# EAGLE schematic display driver rev B (EAGLE 9.6.1)
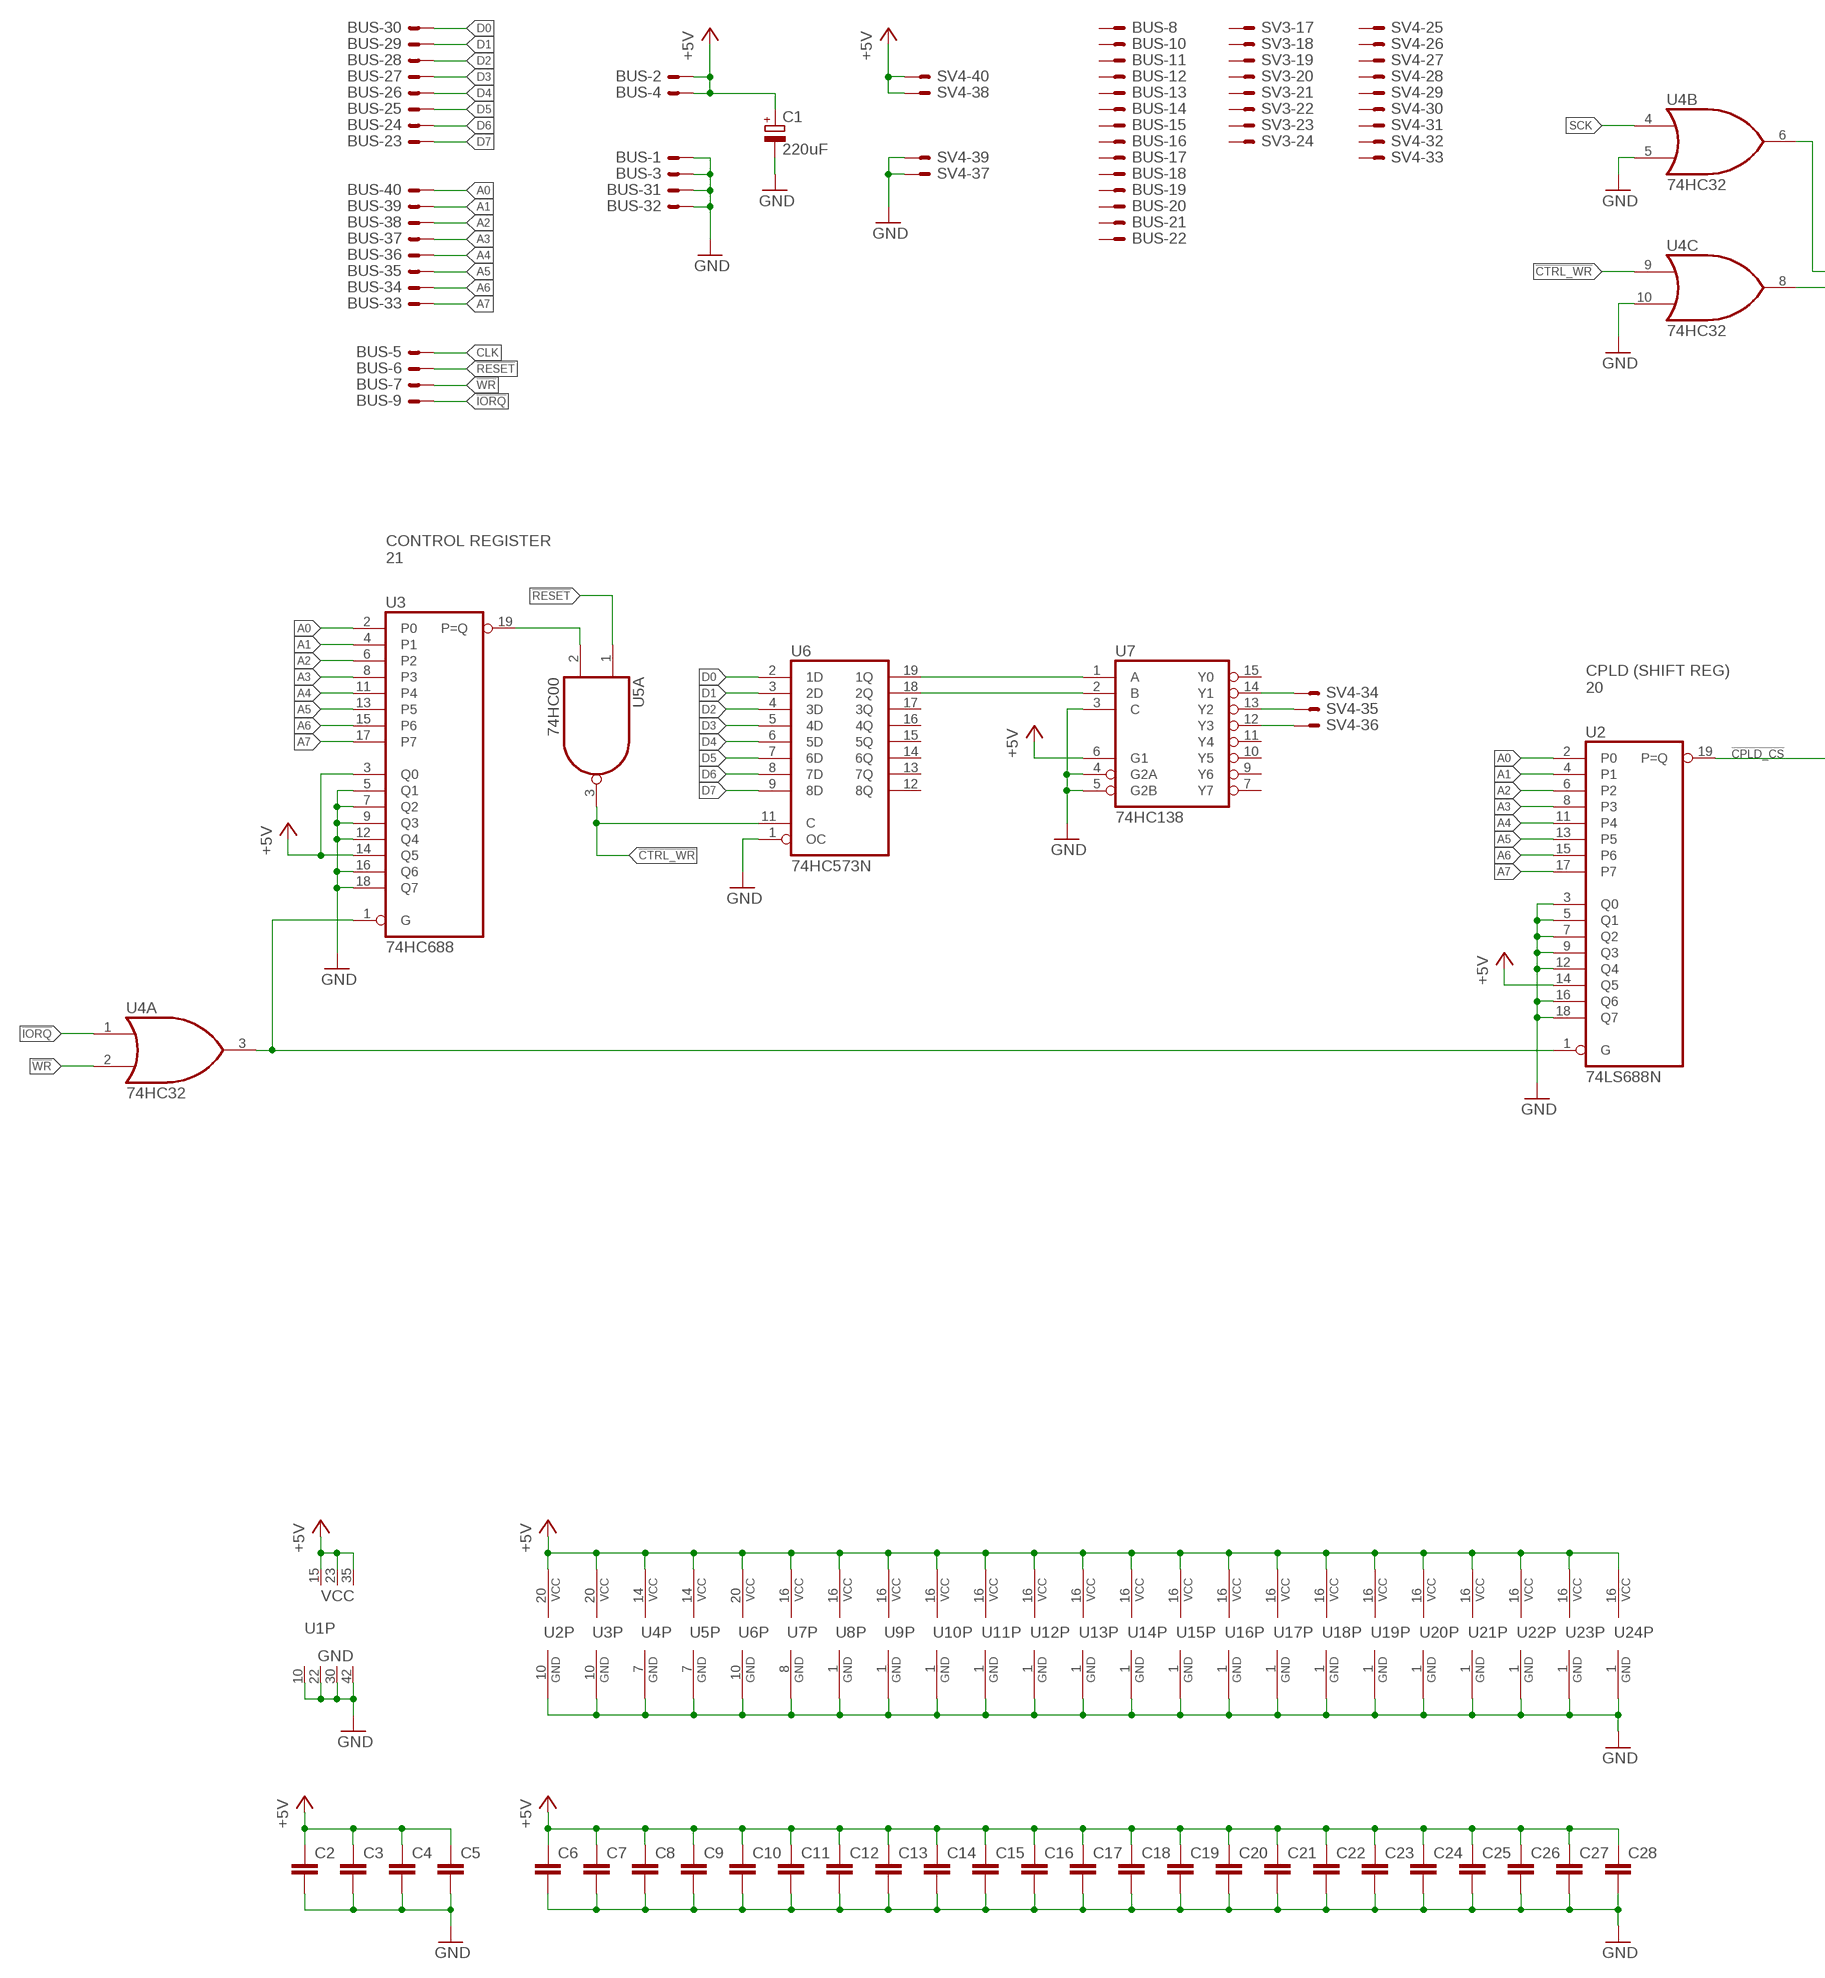
[diagram p0: schematic, sheet 1, part 1 of 2]
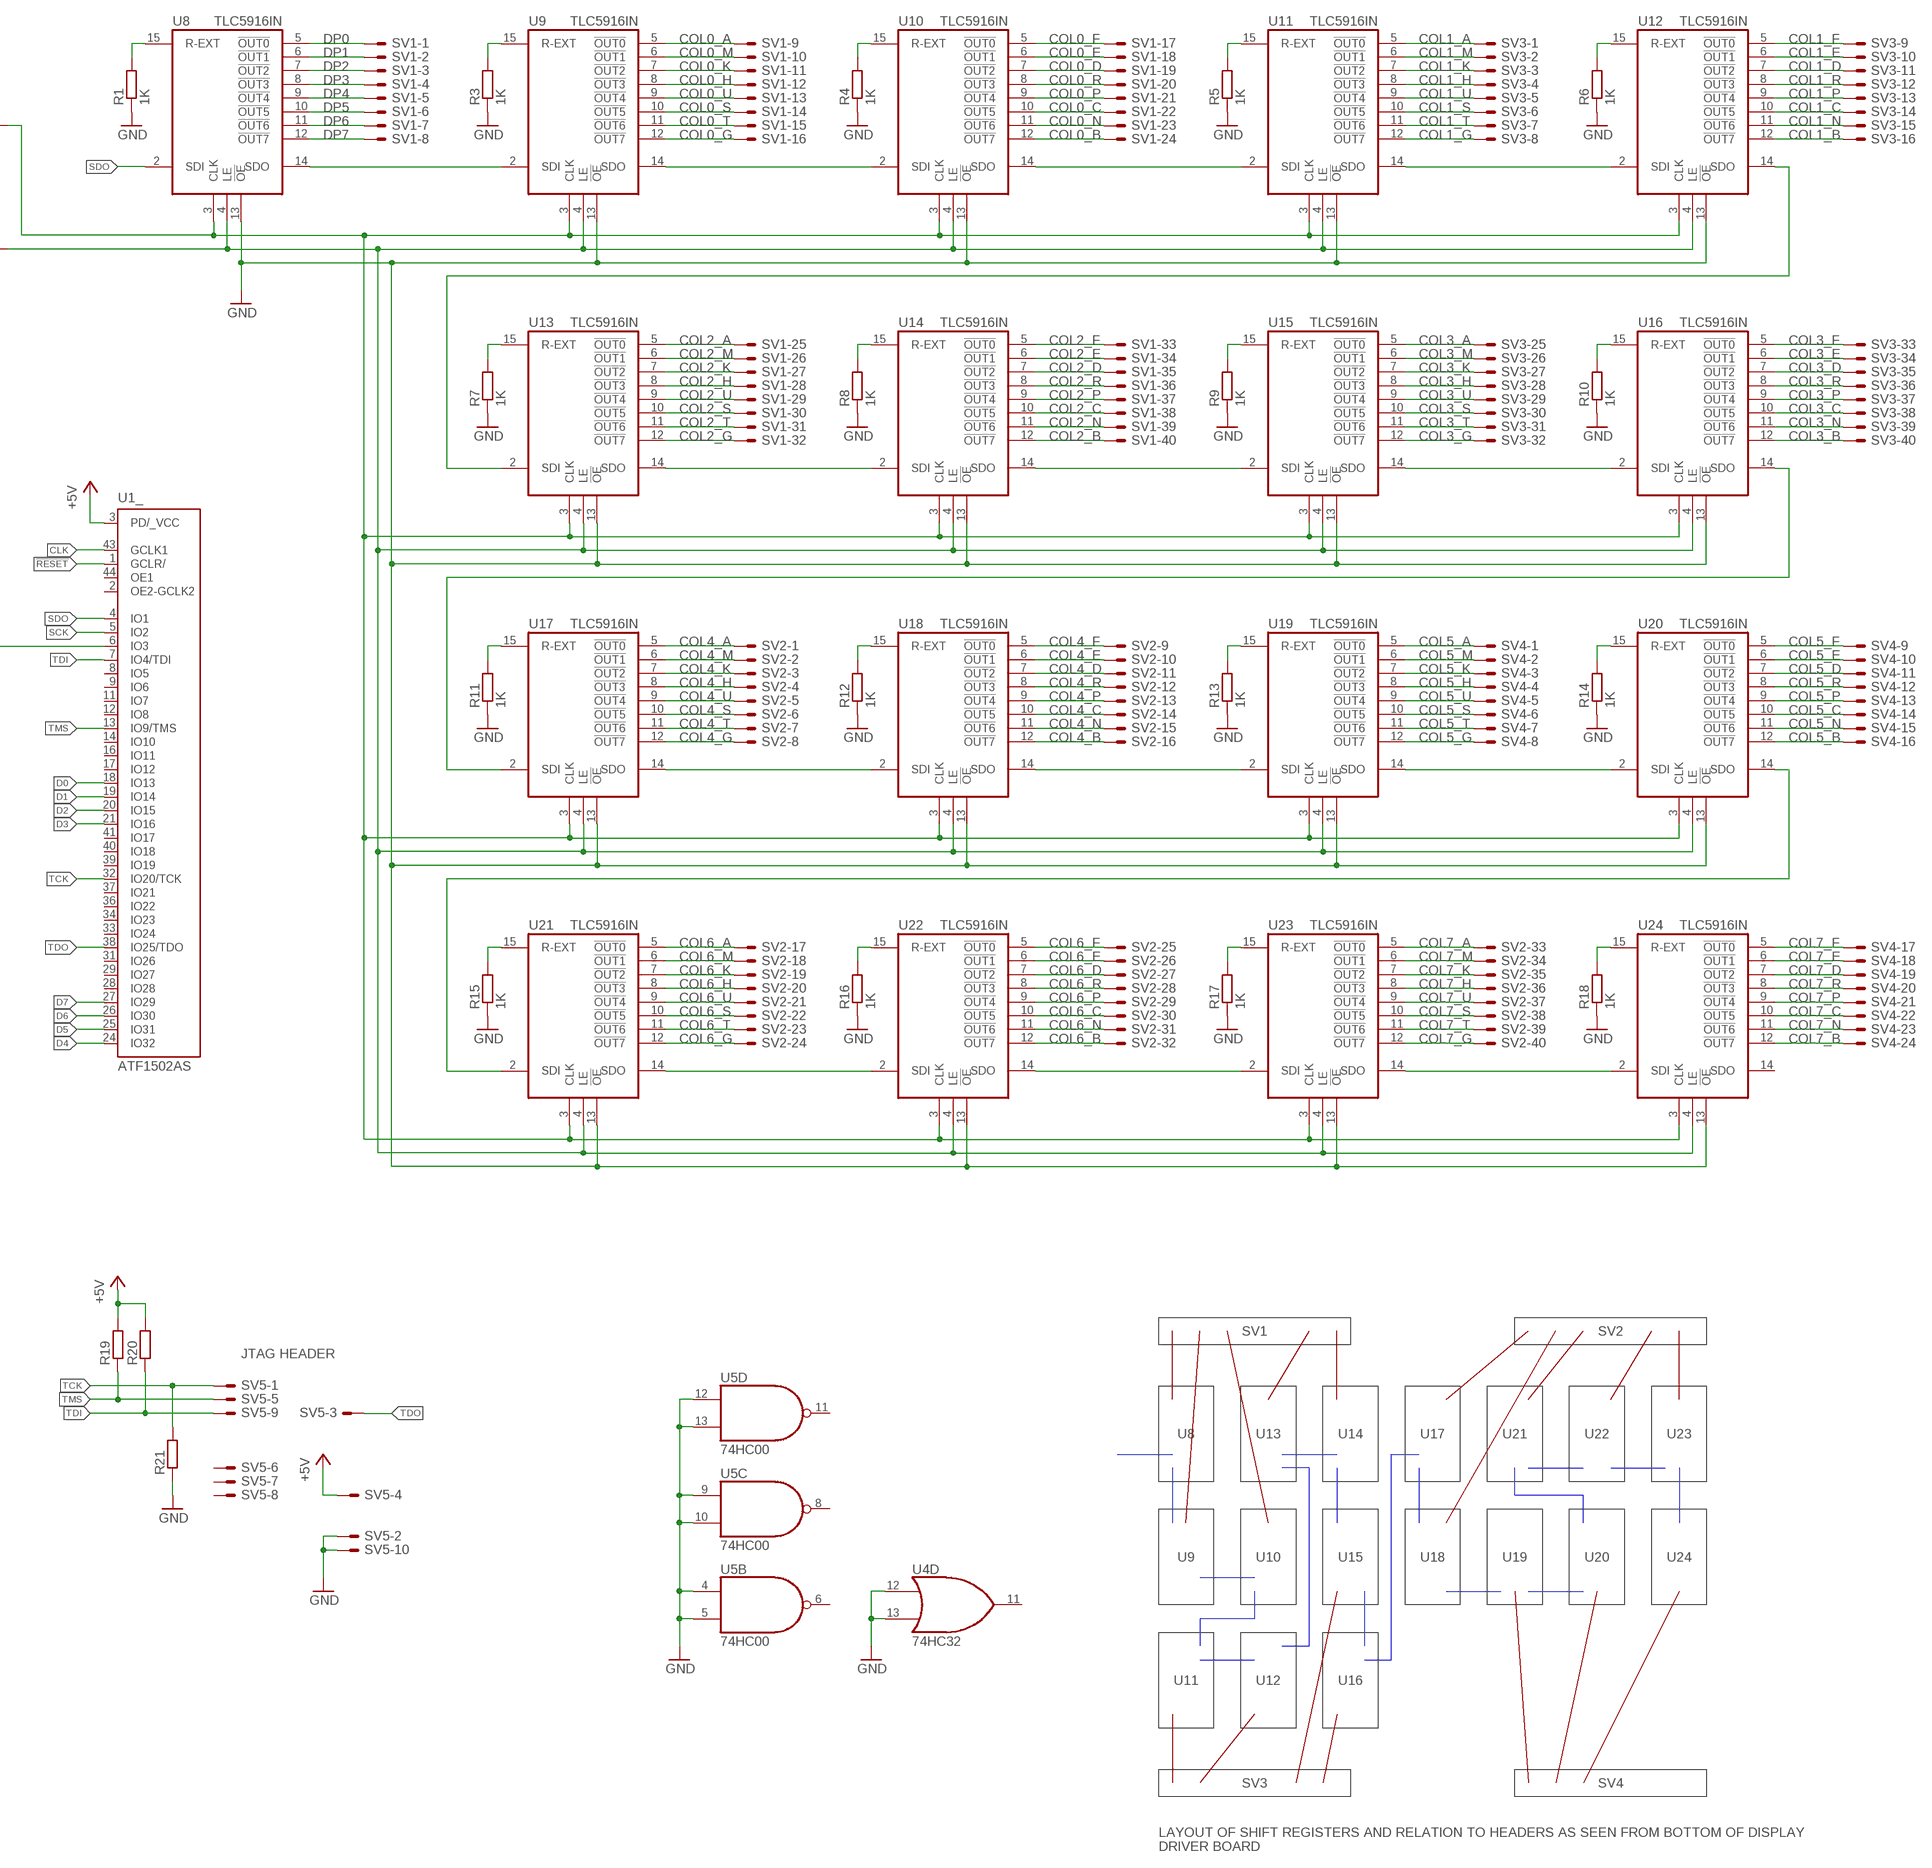
[diagram p1: schematic, sheet 1, part 2 of 2]

## Parts
BUS  ML40E  [ML40]
C1  220uF  CPOL-EUE3.5-8  [E3,5-8]
C2  C-EU050-025X075  [C050-025X075]
C3  C-EU050-025X075  [C050-025X075]
C4  C-EU050-025X075  [C050-025X075]
C5  C-EU050-025X075  [C050-025X075]
C6  C-EU050-025X075  [C050-025X075]
C7  C-EU050-025X075  [C050-025X075]
C8  C-EU050-025X075  [C050-025X075]
C9  C-EU050-025X075  [C050-025X075]
C10  C-EU050-025X075  [C050-025X075]
C11  C-EU050-025X075  [C050-025X075]
C12  C-EU050-025X075  [C050-025X075]
C13  C-EU050-025X075  [C050-025X075]
C14  C-EU050-025X075  [C050-025X075]
C15  C-EU050-025X075  [C050-025X075]
C16  C-EU050-025X075  [C050-025X075]
C17  C-EU050-025X075  [C050-025X075]
C18  C-EU050-025X075  [C050-025X075]
C19  C-EU050-025X075  [C050-025X075]
C20  C-EU050-025X075  [C050-025X075]
C21  C-EU050-025X075  [C050-025X075]
C22  C-EU050-025X075  [C050-025X075]
C23  C-EU050-025X075  [C050-025X075]
C24  C-EU050-025X075  [C050-025X075]
C25  C-EU050-025X075  [C050-025X075]
C26  C-EU050-025X075  [C050-025X075]
C27  C-EU050-025X075  [C050-025X075]
C28  C-EU050-025X075  [C050-025X075]
R1  1K  R-EU_0207/10  [0207/10]
R3  1K  R-EU_0207/10  [0207/10]
R4  1K  R-EU_0207/10  [0207/10]
R5  1K  R-EU_0207/10  [0207/10]
R6  1K  R-EU_0207/10  [0207/10]
R7  1K  R-EU_0207/10  [0207/10]
R8  1K  R-EU_0207/10  [0207/10]
R9  1K  R-EU_0207/10  [0207/10]
R10  1K  R-EU_0207/10  [0207/10]
R11  1K  R-EU_0207/10  [0207/10]
R12  1K  R-EU_0207/10  [0207/10]
R13  1K  R-EU_0207/10  [0207/10]
R14  1K  R-EU_0207/10  [0207/10]
R15  1K  R-EU_0207/10  [0207/10]
R16  1K  R-EU_0207/10  [0207/10]
R17  1K  R-EU_0207/10  [0207/10]
R18  1K  R-EU_0207/10  [0207/10]
R19  R-EU_0207/10  [0207/10]
R20  R-EU_0207/10  [0207/10]
R21  R-EU_0207/10  [0207/10]
SV1  ML40E  [ML40]
SV2  ML40E  [ML40]
SV3  ML40E  [ML40]
SV4  ML40E  [ML40]
SV5  ML10E  [ML10]
U1  ATF1502AS  EPM7032S44  [PLCC-S44]
U2  74LS688N  [DIL20]
U3  74HC688  74LS688N  [DIL20]
U4  74HC32  74LS32N  [DIL14]
U5  74HC00  74LS00N  [DIL14]
U6  74HC573N  [DIL20]
U7  74HC138  74LS138N  [DIL16]
U8  TLC5916IN  [DIL16]
U9  TLC5916IN  [DIL16]
U10  TLC5916IN  [DIL16]
U11  TLC5916IN  [DIL16]
U12  TLC5916IN  [DIL16]
U13  TLC5916IN  [DIL16]
U14  TLC5916IN  [DIL16]
U15  TLC5916IN  [DIL16]
U16  TLC5916IN  [DIL16]
U17  TLC5916IN  [DIL16]
U18  TLC5916IN  [DIL16]
U19  TLC5916IN  [DIL16]
U20  TLC5916IN  [DIL16]
U21  TLC5916IN  [DIL16]
U22  TLC5916IN  [DIL16]
U23  TLC5916IN  [DIL16]
U24  TLC5916IN  [DIL16]

## Nets
!CPLD_CS!: U1.6(_:IO3) U2.19(P=Q)
!CTRL_WR!: U4.9(C:I0) U5.3(A:O) U6.11(C)
!IORQ!: BUS.9 U4.1(A:I0)
!RESET!: BUS.6 U1.1(_:GCLR/) U5.1(A:I0)
!WR!: BUS.7 U4.2(A:I1)
+5V: BUS.2 BUS.4 C1.+ C2.1 C3.1 C4.1 C5.1 C6.1 C7.1 C8.1 C9.1 C10.1 C11.1 C12.1 C13.1 C14.1 C15.1 C16.1 C17.1 C18.1 C19.1 C20.1 C21.1 C22.1 C23.1 C24.1 C25.1 C26.1 C27.1 C28.1 R19.2 R20.2 SV4.38 SV4.40 SV5.4 U1.3(_:PD/_VCC) U1.15(P:VCC) U1.23(P:VCC) U1.35(P:VCC) U2.14(Q5) U2.20(VCC) U3.3(Q0) U3.14(Q5) U3.20(VCC) U4.14(P:VCC) U5.14(P:VCC) U6.20(VCC) U7.6(G1) U7.16(VCC) U8.16(VCC) U9.16(VCC) U10.16(VCC) U11.16(VCC) U12.16(VCC) U13.16(VCC) U14.16(VCC) U15.16(VCC) U16.16(VCC) U17.16(VCC) U18.16(VCC) U19.16(VCC) U20.16(VCC) U21.16(VCC) U22.16(VCC) U23.16(VCC) U24.16(VCC)
A0: BUS.40 U2.2(P0) U3.2(P0)
A1: BUS.39 U2.4(P1) U3.4(P1)
A2: BUS.38 U2.6(P2) U3.6(P2)
A3: BUS.37 U2.8(P3) U3.8(P3)
A4: BUS.36 U2.11(P4) U3.11(P4)
A5: BUS.35 U2.13(P5) U3.13(P5)
A6: BUS.34 U2.15(P6) U3.15(P6)
A7: BUS.33 U2.17(P7) U3.17(P7)
CLK: BUS.5 U1.43(_:GCLK1)
COL0_A: SV1.9 U9.5(!OUT0!)
COL0_B: SV1.24 U10.12(!OUT7!)
COL0_C: SV1.22 U10.10(!OUT5!)
COL0_D: SV1.19 U10.7(!OUT2!)
COL0_E: SV1.18 U10.6(!OUT1!)
COL0_F: SV1.17 U10.5(!OUT0!)
COL0_G: SV1.16 U9.12(!OUT7!)
COL0_H: SV1.12 U9.8(!OUT3!)
COL0_K: SV1.11 U9.7(!OUT2!)
COL0_M: SV1.10 U9.6(!OUT1!)
COL0_N: SV1.23 U10.11(!OUT6!)
COL0_P: SV1.21 U10.9(!OUT4!)
COL0_R: SV1.20 U10.8(!OUT3!)
COL0_S: SV1.14 U9.10(!OUT5!)
COL0_T: SV1.15 U9.11(!OUT6!)
COL0_U: SV1.13 U9.9(!OUT4!)
COL1_A: SV3.1 U11.5(!OUT0!)
COL1_B: SV3.16 U12.12(!OUT7!)
COL1_C: SV3.14 U12.10(!OUT5!)
COL1_D: SV3.11 U12.7(!OUT2!)
COL1_E: SV3.10 U12.6(!OUT1!)
COL1_F: SV3.9 U12.5(!OUT0!)
COL1_G: SV3.8 U11.12(!OUT7!)
COL1_H: SV3.4 U11.8(!OUT3!)
COL1_K: SV3.3 U11.7(!OUT2!)
COL1_M: SV3.2 U11.6(!OUT1!)
COL1_N: SV3.15 U12.11(!OUT6!)
COL1_P: SV3.13 U12.9(!OUT4!)
COL1_R: SV3.12 U12.8(!OUT3!)
COL1_S: SV3.6 U11.10(!OUT5!)
COL1_T: SV3.7 U11.11(!OUT6!)
COL1_U: SV3.5 U11.9(!OUT4!)
COL2_A: SV1.25 U13.5(!OUT0!)
COL2_B: SV1.40 U14.12(!OUT7!)
COL2_C: SV1.38 U14.10(!OUT5!)
COL2_D: SV1.35 U14.7(!OUT2!)
COL2_E: SV1.34 U14.6(!OUT1!)
COL2_F: SV1.33 U14.5(!OUT0!)
COL2_G: SV1.32 U13.12(!OUT7!)
COL2_H: SV1.28 U13.8(!OUT3!)
COL2_K: SV1.27 U13.7(!OUT2!)
COL2_M: SV1.26 U13.6(!OUT1!)
COL2_N: SV1.39 U14.11(!OUT6!)
COL2_P: SV1.37 U14.9(!OUT4!)
COL2_R: SV1.36 U14.8(!OUT3!)
COL2_S: SV1.30 U13.10(!OUT5!)
COL2_T: SV1.31 U13.11(!OUT6!)
COL2_U: SV1.29 U13.9(!OUT4!)
COL3_A: SV3.25 U15.5(!OUT0!)
COL3_B: SV3.40 U16.12(!OUT7!)
COL3_C: SV3.38 U16.10(!OUT5!)
COL3_D: SV3.35 U16.7(!OUT2!)
COL3_E: SV3.34 U16.6(!OUT1!)
COL3_F: SV3.33 U16.5(!OUT0!)
COL3_G: SV3.32 U15.12(!OUT7!)
COL3_H: SV3.28 U15.8(!OUT3!)
COL3_K: SV3.27 U15.7(!OUT2!)
COL3_M: SV3.26 U15.6(!OUT1!)
COL3_N: SV3.39 U16.11(!OUT6!)
COL3_P: SV3.37 U16.9(!OUT4!)
COL3_R: SV3.36 U16.8(!OUT3!)
COL3_S: SV3.30 U15.10(!OUT5!)
COL3_T: SV3.31 U15.11(!OUT6!)
COL3_U: SV3.29 U15.9(!OUT4!)
COL4_A: SV2.1 U17.5(!OUT0!)
COL4_B: SV2.16 U18.12(!OUT7!)
COL4_C: SV2.14 U18.10(!OUT5!)
COL4_D: SV2.11 U18.7(!OUT2!)
COL4_E: SV2.10 U18.6(!OUT1!)
COL4_F: SV2.9 U18.5(!OUT0!)
COL4_G: SV2.8 U17.12(!OUT7!)
COL4_H: SV2.4 U17.8(!OUT3!)
COL4_K: SV2.3 U17.7(!OUT2!)
COL4_M: SV2.2 U17.6(!OUT1!)
COL4_N: SV2.15 U18.11(!OUT6!)
COL4_P: SV2.13 U18.9(!OUT4!)
COL4_R: SV2.12 U18.8(!OUT3!)
COL4_S: SV2.6 U17.10(!OUT5!)
COL4_T: SV2.7 U17.11(!OUT6!)
COL4_U: SV2.5 U17.9(!OUT4!)
COL5_A: SV4.1 U19.5(!OUT0!)
COL5_B: SV4.16 U20.12(!OUT7!)
COL5_C: SV4.14 U20.10(!OUT5!)
COL5_D: SV4.11 U20.7(!OUT2!)
COL5_E: SV4.10 U20.6(!OUT1!)
COL5_F: SV4.9 U20.5(!OUT0!)
COL5_G: SV4.8 U19.12(!OUT7!)
COL5_H: SV4.4 U19.8(!OUT3!)
COL5_K: SV4.3 U19.7(!OUT2!)
COL5_M: SV4.2 U19.6(!OUT1!)
COL5_N: SV4.15 U20.11(!OUT6!)
COL5_P: SV4.13 U20.9(!OUT4!)
COL5_R: SV4.12 U20.8(!OUT3!)
COL5_S: SV4.6 U19.10(!OUT5!)
COL5_T: SV4.7 U19.11(!OUT6!)
COL5_U: SV4.5 U19.9(!OUT4!)
COL6_A: SV2.17 U21.5(!OUT0!)
COL6_B: SV2.32 U22.12(!OUT7!)
COL6_C: SV2.30 U22.10(!OUT5!)
COL6_D: SV2.27 U22.7(!OUT2!)
COL6_E: SV2.26 U22.6(!OUT1!)
COL6_F: SV2.25 U22.5(!OUT0!)
COL6_G: SV2.24 U21.12(!OUT7!)
COL6_H: SV2.20 U21.8(!OUT3!)
COL6_K: SV2.19 U21.7(!OUT2!)
COL6_M: SV2.18 U21.6(!OUT1!)
COL6_N: SV2.31 U22.11(!OUT6!)
COL6_P: SV2.29 U22.9(!OUT4!)
COL6_R: SV2.28 U22.8(!OUT3!)
COL6_S: SV2.22 U21.10(!OUT5!)
COL6_T: SV2.23 U21.11(!OUT6!)
COL6_U: SV2.21 U21.9(!OUT4!)
COL7_A: SV2.33 U23.5(!OUT0!)
COL7_B: SV4.24 U24.12(!OUT7!)
COL7_C: SV4.22 U24.10(!OUT5!)
COL7_D: SV4.19 U24.7(!OUT2!)
COL7_E: SV4.18 U24.6(!OUT1!)
COL7_F: SV4.17 U24.5(!OUT0!)
COL7_G: SV2.40 U23.12(!OUT7!)
COL7_H: SV2.36 U23.8(!OUT3!)
COL7_K: SV2.35 U23.7(!OUT2!)
COL7_M: SV2.34 U23.6(!OUT1!)
COL7_N: SV4.23 U24.11(!OUT6!)
COL7_P: SV4.21 U24.9(!OUT4!)
COL7_R: SV4.20 U24.8(!OUT3!)
COL7_S: SV2.38 U23.10(!OUT5!)
COL7_T: SV2.39 U23.11(!OUT6!)
COL7_U: SV2.37 U23.9(!OUT4!)
D0: BUS.30 U1.18(_:IO13) U6.2(1D)
D1: BUS.29 U1.19(_:IO14) U6.3(2D)
D2: BUS.28 U1.20(_:IO15) U6.4(3D)
D3: BUS.27 U1.21(_:IO16) U6.5(4D)
D4: BUS.26 U1.24(_:IO32) U6.6(5D)
D5: BUS.25 U1.25(_:IO31) U6.7(6D)
D6: BUS.24 U1.26(_:IO30) U6.8(7D)
D7: BUS.23 U1.27(_:IO29) U6.9(8D)
DP0: SV1.1 U8.5(!OUT0!)
DP1: SV1.2 U8.6(!OUT1!)
DP2: SV1.3 U8.7(!OUT2!)
DP3: SV1.4 U8.8(!OUT3!)
DP4: SV1.5 U8.9(!OUT4!)
DP5: SV1.6 U8.10(!OUT5!)
DP6: SV1.7 U8.11(!OUT6!)
DP7: SV1.8 U8.12(!OUT7!)
GND: BUS.1 BUS.3 BUS.31 BUS.32 C1.- C2.2 C3.2 C4.2 C5.2 C6.2 C7.2 C8.2 C9.2 C10.2 C11.2 C12.2 C13.2 C14.2 C15.2 C16.2 C17.2 C18.2 C19.2 C20.2 C21.2 C22.2 C23.2 C24.2 C25.2 C26.2 C27.2 C28.2 R1.1 R3.1 R4.1 R5.1 R6.1 R7.1 R8.1 R9.1 R10.1 R11.1 R12.1 R13.1 R14.1 R15.1 R16.1 R17.1 R18.1 R21.1 SV4.37 SV4.39 SV5.2 SV5.10 U1.10(P:GND) U1.22(P:GND) U1.30(P:GND) U1.42(P:GND) U2.3(Q0) U2.5(Q1) U2.7(Q2) U2.9(Q3) U2.10(GND) U2.12(Q4) U2.16(Q6) U2.18(Q7) U3.5(Q1) U3.7(Q2) U3.9(Q3) U3.10(GND) U3.12(Q4) U3.16(Q6) U3.18(Q7) U4.5(B:I1) U4.7(P:GND) U4.10(C:I1) U4.12(D:I0) U4.13(D:I1) U5.4(B:I0) U5.5(B:I1) U5.7(P:GND) U5.9(C:I0) U5.10(C:I1) U5.12(D:I0) U5.13(D:I1) U6.1(OC) U6.10(GND) U7.3(C) U7.4(G2A) U7.5(G2B) U7.8(GND) U8.1(GND) U8.13(!OE!) U9.1(GND) U9.13(!OE!) U10.1(GND) U10.13(!OE!) U11.1(GND) U11.13(!OE!) U12.1(GND) U12.13(!OE!) U13.1(GND) U13.13(!OE!) U14.1(GND) U14.13(!OE!) U15.1(GND) U15.13(!OE!) U16.1(GND) U16.13(!OE!) U17.1(GND) U17.13(!OE!) U18.1(GND) U18.13(!OE!) U19.1(GND) U19.13(!OE!) U20.1(GND) U20.13(!OE!) U21.1(GND) U21.13(!OE!) U22.1(GND) U22.13(!OE!) U23.1(GND) U23.13(!OE!) U24.1(GND) U24.13(!OE!)
N$1: U3.19(P=Q) U4.6(B:O) U5.2(A:I1) U8.3(CLK) U9.3(CLK) U10.3(CLK) U11.3(CLK) U12.3(CLK) U13.3(CLK) U14.3(CLK) U15.3(CLK) U16.3(CLK) U17.3(CLK) U18.3(CLK) U19.3(CLK) U20.3(CLK) U21.3(CLK) U22.3(CLK) U23.3(CLK) U24.3(CLK)
N$3: SV4.34 U7.14(Y1)
N$4: U6.19(1Q) U7.1(A)
N$5: U6.18(2Q) U7.2(B)
N$6: SV4.35 U7.13(Y2)
N$7: SV4.36 U7.12(Y3)
N$8: R1.2 U8.15(R-EXT)
N$17: R3.2 U9.15(R-EXT)
N$18: R4.2 U10.15(R-EXT)
N$19: R5.2 U11.15(R-EXT)
N$20: R6.2 U12.15(R-EXT)
N$21: R7.2 U13.15(R-EXT)
N$22: R8.2 U14.15(R-EXT)
N$23: R9.2 U15.15(R-EXT)
N$24: R10.2 U16.15(R-EXT)
N$25: R11.2 U17.15(R-EXT)
N$26: R12.2 U18.15(R-EXT)
N$27: R13.2 U19.15(R-EXT)
N$28: R14.2 U20.15(R-EXT)
N$29: R15.2 U21.15(R-EXT)
N$30: R16.2 U22.15(R-EXT)
N$31: R17.2 U23.15(R-EXT)
N$32: R18.2 U24.15(R-EXT)
N$33: U8.14(SDO) U9.2(SDI)
N$34: U9.14(SDO) U10.2(SDI)
N$35: U10.14(SDO) U11.2(SDI)
N$36: U11.14(SDO) U12.2(SDI)
N$37: U13.14(SDO) U14.2(SDI)
N$38: U14.14(SDO) U15.2(SDI)
N$39: U15.14(SDO) U16.2(SDI)
N$40: U17.14(SDO) U18.2(SDI)
N$41: U18.14(SDO) U19.2(SDI)
N$42: U19.14(SDO) U20.2(SDI)
N$43: U21.14(SDO) U22.2(SDI)
N$44: U22.14(SDO) U23.2(SDI)
N$45: U23.14(SDO) U24.2(SDI)
N$53: U4.8(C:O) U8.4(LE) U9.4(LE) U10.4(LE) U11.4(LE) U12.4(LE) U13.4(LE) U14.4(LE) U15.4(LE) U16.4(LE) U17.4(LE) U18.4(LE) U19.4(LE) U20.4(LE) U21.4(LE) U22.4(LE) U23.4(LE) U24.4(LE)
N$55: U12.14(SDO) U13.2(SDI)
N$56: U16.14(SDO) U17.2(SDI)
N$57: U20.14(SDO) U21.2(SDI)
N$177: U2.1(G) U3.1(G) U4.3(A:O)
SCK: U1.5(_:IO2) U4.4(B:I0)
SDO: U1.4(_:IO1) U8.2(SDI)
TCK: R21.2 SV5.1 U1.32(_:IO20/TCK)
TDI: R20.1 SV5.9 U1.7(_:IO4/TDI)
TDO: SV5.3 U1.38(_:IO25/TDO)
TMS: R19.1 SV5.5 U1.13(_:IO9/TMS)
Unconnected: BUS.8 BUS.10 BUS.11 BUS.12 BUS.13 BUS.14 BUS.15 BUS.16 BUS.17 BUS.18 BUS.19 BUS.20 BUS.21 BUS.22 SV3.17 SV3.18 SV3.19 SV3.20 SV3.21 SV3.22 SV3.23 SV3.24 SV4.25 SV4.26 SV4.27 SV4.28 SV4.29 SV4.30 SV4.31 SV4.32 SV4.33 SV5.6 SV5.7 SV5.8 U1.2(_:OE2-GCLK2) U1.8(_:IO5) U1.9(_:IO6) U1.11(_:IO7) U1.12(_:IO8) U1.14(_:IO10) U1.16(_:IO11) U1.17(_:IO12) U1.28(_:IO28) U1.29(_:IO27) U1.31(_:IO26) U1.33(_:IO24) U1.34(_:IO23) U1.36(_:IO22) U1.37(_:IO21) U1.39(_:IO19) U1.40(_:IO18) U1.41(_:IO17) U1.44(_:OE1) U4.11(D:O) U5.6(B:O) U5.8(C:O) U5.11(D:O) U6.12(8Q) U6.13(7Q) U6.14(6Q) U6.15(5Q) U6.16(4Q) U6.17(3Q) U7.7(Y7) U7.9(Y6) U7.10(Y5) U7.11(Y4) U7.15(Y0) U24.14(SDO)

## Notes on the sheet
- CONTROL REGISTER
  21
- CPLD (SHIFT REG)
  20
- SV1 | SV2
- JTAG HEADER
- U8 | U13 | U14 | U17 | U21 | U22 | U23
- U9 | U10 | U15 | U18 | U19 | U20 | U24
- U11 | U12 | U16
- SV3 | SV4
- LAYOUT OF SHIFT REGISTERS AND RELATION TO HEADERS AS SEEN FROM BOTTOM OF DISPLAY
  DRIVER BOARD

## Library data of the parts
BUS SV1-SV4 = con-ml:ML40E: HARTING; OC_FARNELL: unknown; OC_NEWARK: unknown
C1 = rcl:CPOL-EU: POLARIZED CAPACITOR, European symbol
C2-C28 = rcl:C-EU: CAPACITOR, European symbol
R1 R3-R21 = rcl:R-EU_: RESISTOR, European symbol
SV5 = con-ml:ML10E: HARTING; OC_FARNELL: unknown; OC_NEWARK: unknown
U1 = altera:EPM7032: EPM7032 MAX 7000 family; MPN: EPM7032SLC44-6N; OC_FARNELL: 1549447; OC_NEWARK: 51R9532
U2 U3 = 74xx-us:74*688: 8-bit MAGNITUDE/IDENTITY COMPARATOR, totem pole
U4 = 74xx-us:74*32: Quad 2-input OR gate
U5 = 74xx-us:74*00: Quad 2-input NAND gate
U6 = 74xx-us:74*573: 8-bit D latch BUS DRIVER
U7 = 74xx-us:74*138: 3-line to 8-line DECODER/DEMULTIPLEXER
U8-U24 = Z80 clock:TLC5916I